# Altium project baggylimiter.PrjPCB
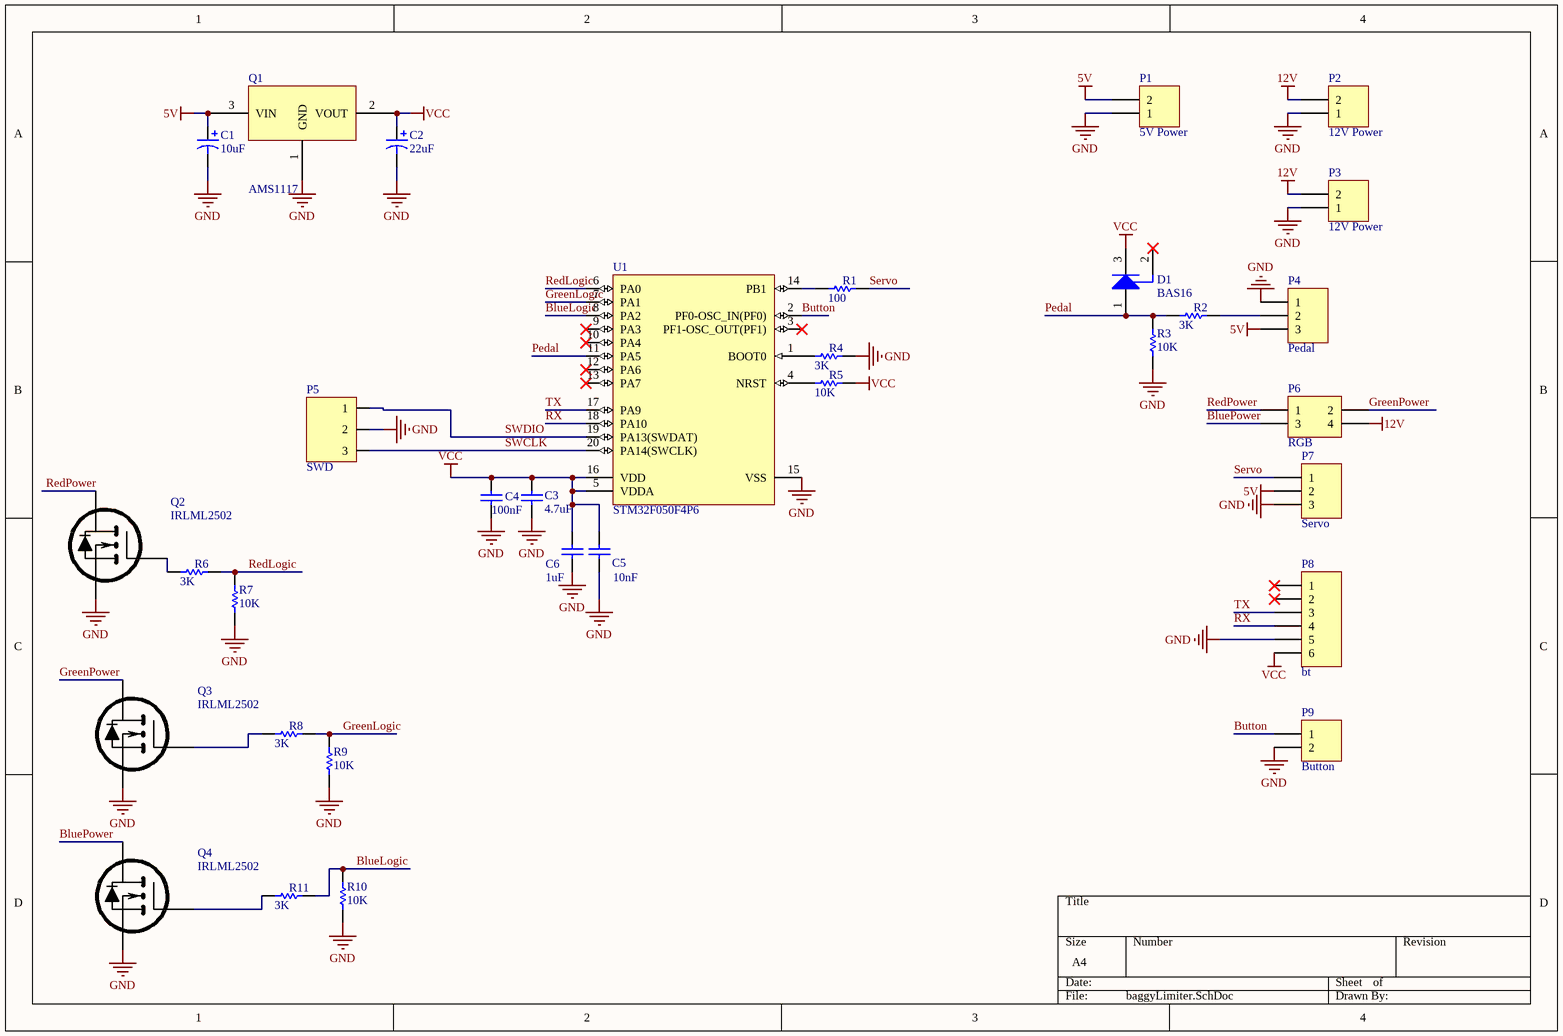
[diagram p0: baggyLimiter.SchDoc]
1 sheet, 32 parts. Net scope: global (net labels, ports and power ports of the same name join across sheets).
Board file: pcb.PcbDoc

## Sheet baggyLimiter.SchDoc
size A4

### Parts
C1  10uF  [CAPMP3528X210N]
C2  22uF  [CAPMP3528X210N]
C3  4.7uF  [CAPC0805(2012)145_M]
C4  100nF  [CAPC0805(2012)100_M]
C5  10nF  [CAPC0805(2012)100_N]
C6  1uF  [CAPC0805(2012)145_M]
D1  BAS16  [INF-SOT23_L]
P1  5V Power  [15EDGRC-3.5-02P]
P2  12V Power  [15EDGRC-3.5-02P]
P3  12V Power  [15EDGRC-3.5-02P]
P4  Pedal  [15EDGRC-3.5-03P]
P5  SWD  [Line 2.54 X 3]
P6  RGB  [15EDGRC-3.5-04P]
P7  Servo  [15EDGRC-3.5-03P]
P8  bt  [HDR1X6]
P9  Button  [15EDGRC-3.5-02P]
Q1  AMS1117  [SOT223]
Q2  IRLML2502  [SOT-23_N]
Q3  IRLML2502  [SOT-23_N]
Q4  IRLML2502  [SOT-23_N]
R1  100  [RESC0603(1608)_M]
R2  3K  [RESC0603(1608)_M]
R3  10K  [RESC0603(1608)_M]
R4  3K  [RESC0603(1608)_M]
R5  10K  [RESC0603(1608)_M]
R6  3K  [RESC0603(1608)_M]
R7  10K  [RESC0603(1608)_M]
R8  3K  [RESC0603(1608)_M]
R9  10K  [RESC0603(1608)_M]
R10  10K  [RESC0603(1608)_M]
R11  3K  [RESC0603(1608)_M]
U1  STM32F050F4P6  [STM-TSSOP20_M]

### Nets
5V: C1.1 P1.2 P4.3 P7.2 Q1.3(VIN)
12V: P2.2 P3.2 P6.4
GND: C1.2 C2.2 C3.1 C4.1 C5.1 C6.1 P1.1 P2.1 P3.1 P4.1 P5.2 P7.3 P8.5 P9.2 Q1.1(GND) Q2.2 Q3.2 Q4.2 R3.1 R4.2 R7.1 R9.1 R10.1 U1.15(VSS)
VCC: C2.1 C3.2 C4.2 C5.2 C6.2 D1.3(K) P8.6 Q1.2(VOUT) R5.2 U1.5(VDDA) U1.16(VDD)
BlueLogic: R10.2 R11.2 U1.8(PA2)
BluePower: P6.3 Q4.3
Button: P9.1 U1.2(PF0-OSC_IN(PF0))
GreenLogic: R8.2 R9.2 U1.7(PA1)
GreenPower: P6.2 Q3.3
Pedal: D1.1(A) R2.1 R3.2 U1.11(PA5)
RedLogic: R6.2 R7.2 U1.6(PA0)
RedPower: P6.1 Q2.3
RX: P8.4 U1.18(PA10)
Servo: P7.1 R1.2
SWCLK: P5.3 U1.20(PA14(SWCLK))
SWDIO: P5.1 U1.19(PA13(SWDAT))
TX: P8.3 U1.17(PA9)
NetP4_2: P4.2 R2.2
NetQ2_1: Q2.1 R6.1
NetQ3_1: Q3.1 R8.1
NetQ4_1: Q4.1 R11.1
NetR1_1: R1.1 U1.14(PB1)
NetR4_1: R4.1 U1.1(BOOT0)
NetR5_1: R5.1 U1.4(NRST)

Not connected (* = marked no-connect by the designer): D1 2(NC)*; P8 1* 2*; U1 3(PF1-OSC_OUT(PF1))* 9(PA3)* 10(PA4)* 12(PA6)* 13(PA7)*

### Library data of the parts
C1 C2 = CMP-0279-00001-1: Capacitor, Tantalum, 10uF 10% 20V MCCT-B (3528); PartNumber: TAJB106K020R; Manufacturer: AVX; Polarity: Polarized; PackageDescription: 2-Pin SMT Capacitor, 3.5 x 2.8 mm Body; ComponentLink1URL: http://www.avx.com/; PackageReference: CAPC3528; ComponentLink2Description: Datasheet; Capacitance: 10uF; Technology: Tantalum; ComponentLink2URL: http://www.avx.com/docs/Catalogs/taj.pdf; Tolerance: 10%; ComponentLink1Description: Manufacturer URL; Rated Voltage: 20V; DatasheetVersion: Jun-13; Mounting Technology: Surface Mount
C3 = CMP-1036-04901-1: CAP 4.7uF 50V ±20% 0805 (2012 Metric) Thickness 1.45mm SMD; Case-Metric: 2012; Case-EIA: 0805; Tolerance: ±20%; Technology: SMT; Value: 4.7uF; Max Thickness: 1.45 mm; Rated Voltage: 50 V
C4 = CMP-1036-04420-1: CAP 100nF 50V ±10% 0805 (2012 Metric) Thickness 1mm SMD; Case-EIA: 0805; Case-Metric: 2012; Rated Voltage: 50 V; Value: 100nF; Tolerance: ±10%; Max Thickness: 1 mm; Technology: SMT
C5 = CMP-1036-03844-1: CAP 10nF 50V ±10% 0805 (2012 Metric) Thickness 1mm SMD; Case-Metric: 2012; Case-EIA: 0805; Technology: SMT; Value: 10nF; Rated Voltage: 50 V; Tolerance: ±10%; Max Thickness: 1 mm
C6 = CMP-1036-04763-1: CAP 1uF 50V ±20% 0805 (2012 Metric) Thickness 1.45mm SMD; Case-Metric: 2012; Case-EIA: 0805; Rated Voltage: 50 V; Max Thickness: 1.45 mm; Technology: SMT; Tolerance: ±20%; Value: 1uF
D1 = CMP-1176-00017-1: Silicon Switching Diode, SOT23, Reel, Green; Manufacturer: Infineon; VR (max): 80 V; VBR (min): 85 V; Configuration: Single; Green: TRUE; VF (max): 1.25 V; trr (max): 4 ns; IF (max): 250 mA; IR (max): 100 nA; ComponentLink3Description: Package Specification; PackageVersion: Apr-08; PackageReference: SOT23; ComponentLink2URL: http://www.infineon.com/dgdl/bas16series.pdf?folderId=db3a30431400ef6801141b5844e103ea&fileId=db3a30431400ef6801141b93811b03ff; Mounting Technology: Surface Mount; PartNumber: BAS16; ComponentLink2Description: Datasheet; ComponentLink1Description: Manufacturer URL; ComponentLink1URL: http://www.infineon.com/; ComponentLink3URL: http://www.infineon.com/dgdl/SOT23-Package_Overview.pdf?folderId=db3a30431936bc4b0119532290053c66&fileId=db3a30431936bc4b0119533468123c85; PackageDescription: 3-Pin Small Outline Transistor Package, 1.3 x 2.9 mm Body, 0.95 mm Pitch
P1-P3 P9 = Header 2: Header, 2-Pin; LatestRevisionDate: 17-Jul-2002; LatestRevisionNote: Re-released for DXP Platform.; Publisher: Altium Limited
P4 P7 = Header 3: Header, 3-Pin; LatestRevisionDate: 17-Jul-2002; LatestRevisionNote: Re-released for DXP Platform.; Publisher: Altium Limited
P5 = PLS-3: Vert, Sgl line, Male
P6 = Header 2X2: Header, 2-Pin, Dual row; LatestRevisionDate: 17-Jul-2002; LatestRevisionNote: Re-released for DXP Platform.; Publisher: Altium Limited
P8 = Header 6: Header, 6-Pin; LatestRevisionDate: 17-Jul-2002; LatestRevisionNote: Re-released for DXP Platform.; Publisher: Altium Limited
Q1 = AMS1117: AMS1117, 1A Low dropout voltage regulator
Q2-Q4 = IRLML2502: Type: Field transistor
R1-R11 = CMP-1012-00085-1: 3K 0.1W 5% 0603 (1608 Metric)  SMD; Case-EIA: 0603; Case-Metric: 1608; Value: 3000.00 Ohm; Power: 0.1 W; Tolerance: 5 %; Technology: SMT
U1 = CMP-0304-00038-2: ARM Cortex-M0 32-bit MCU, 16 KB Flash, 4 KB Internal RAM, 15 I/Os, 20-pin TSSOP, -40 to 85 degC, Tube; Supply Voltage(Vcc) min (V): 2; Internal RAM Size (kB): 4; I/Os (High Current): 15; Operating Frequency(F) (Processor speed) (MHz): 48; FLASH Size (Prog) (kB): 16; ComponentLink2Description: Datasheet; PackageDescription: 20-Pin Thin Shrink Small Outline Package, 6.5 x 4.4 mm Body, 0.65 mm Pitch; ComponentLink1Description: Manufacturer URL; Packing: Tube; DatasheetVersion: Rev. 1; Mounting Technology: Surface Mount; ComponentLink3Description: Package Specification; PartNumber: STM32F050F4P6; PackageVersion: Rev. 1, 11/2012; Core: ARM Cortex-M0; ComponentLink3URL: http://www.st.com/st-web-ui/static/active/en/resource/technical/document/datasheet/DM00065136.pdf; PackageReference: TSSOP20; ComponentLink2URL: http://www.st.com/st-web-ui/static/active/en/resource/technical/document/datasheet/DM00065136.pdf; ComponentLink1URL: http://www.st.com/web/en/home.html